# EAGLE design Teensy_setup (EAGLE 9.4.2)
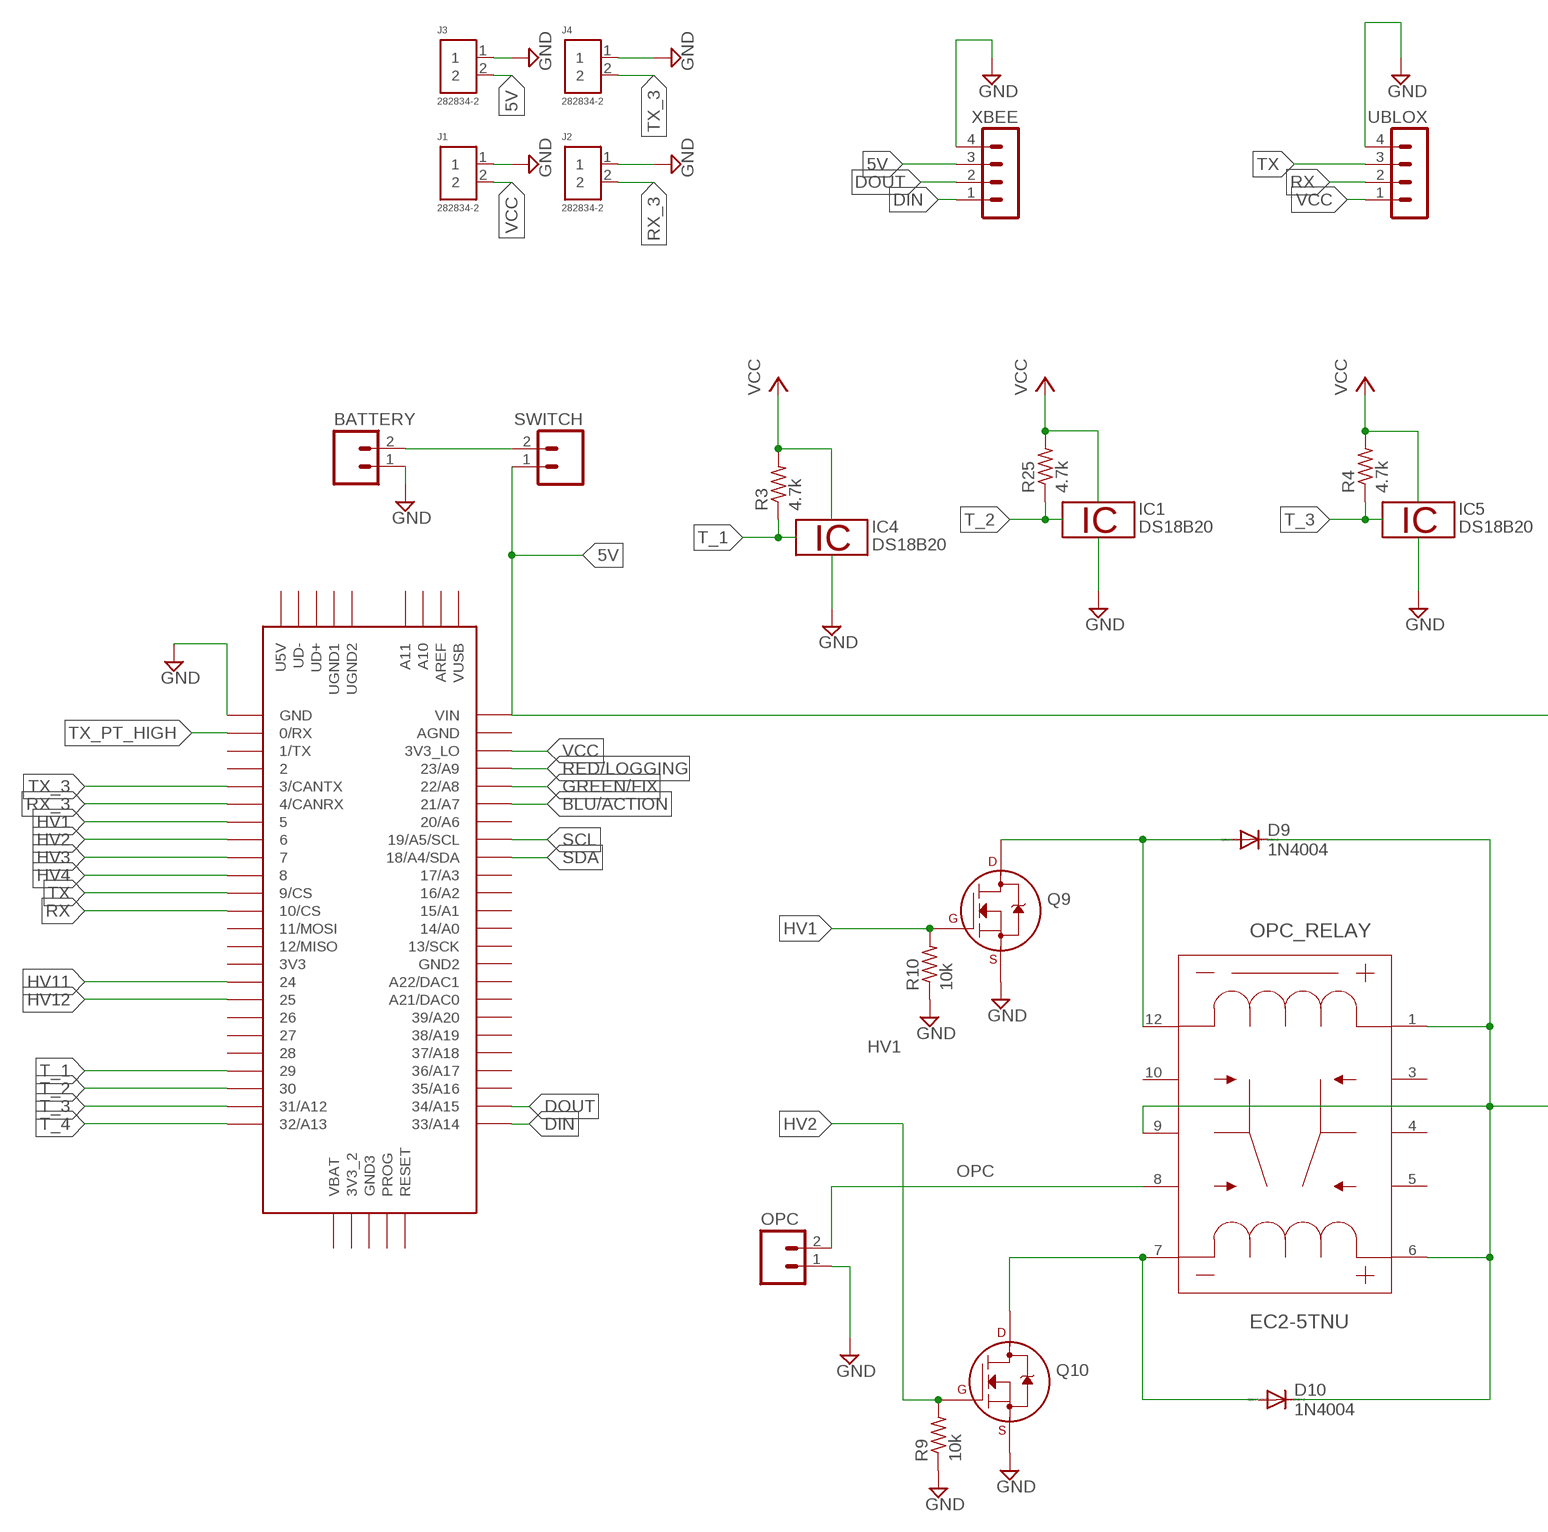
[diagram p0: schematic, sheet 1, part 1 of 2]
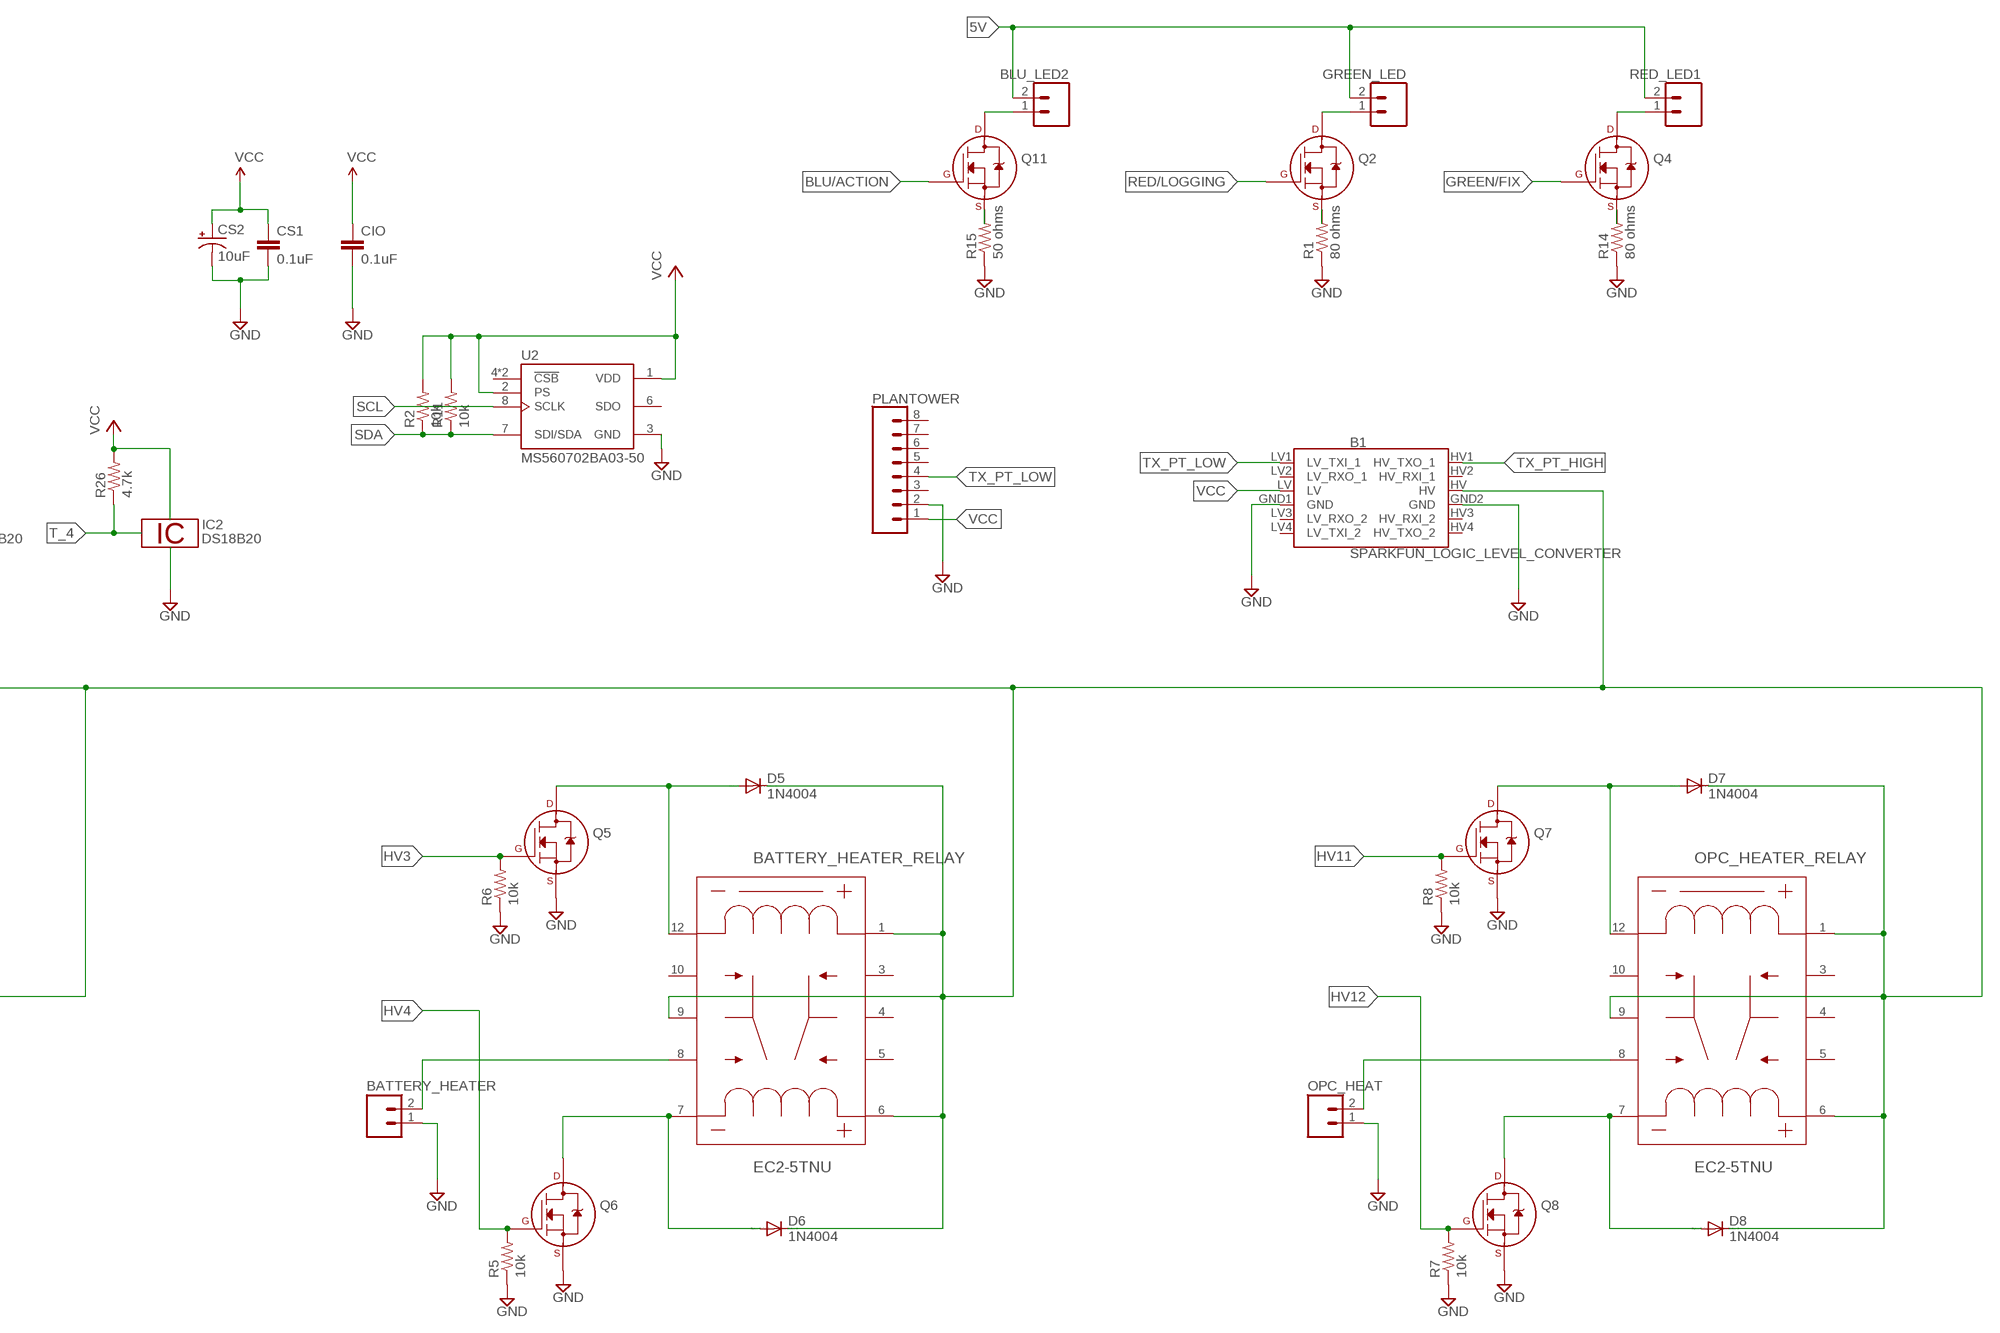
[diagram p1: schematic, sheet 1, part 2 of 2]

## Parts
B1  SPARKFUN_LOGIC_LEVEL_CONVERTER  [SPARKFUN_LOGIC_LEVEL_CONVERTER]
BATTERY  M02  [02P]
BATTERY_HEATER  M02  [02P]
BATTERY_HEATER_RELAY  EC2-5TNU  [EC2TNU]
BLU_LED2  M02  [02P]
CIO  0.1uF  CAP0402-CAP  [0402-CAP]
CS1  0.1uF  CAP0402-CAP  [0402-CAP]
CS2  10uF  CAP_POL1206  [EIA3216]
D5  1N4004  [DO41-10]
D6  1N4004  [DO41-10]
D7  1N4004  [DO41-10]
D8  1N4004  [DO41-10]
D9  1N4004  [DO41-10]
D10  1N4004  [DO41-10]
GREEN_LED  M02  [02P]
IC1  DS18B20  [TO92-]
IC2  DS18B20  [TO92-]
IC4  DS18B20  [TO92-]
IC5  DS18B20  [TO92-]
J1  282834-2  [CONN_282834-2]
J2  282834-2  [CONN_282834-2]
J3  282834-2  [CONN_282834-2]
J4  282834-2  [CONN_282834-2]
OPC  M02  [02P]
OPC_HEAT  M02  [02P]
OPC_HEATER_RELAY  EC2-5TNU  [EC2TNU]
OPC_RELAY  EC2-5TNU  [EC2TNU]
PLANTOWER  CONN_08"  [1X08]
Q2  2N7000_TO92  [TO-92]
Q4  2N7000_TO92  [TO-92]
Q5  2N7000_TO92  [TO-92]
Q6  2N7000_TO92  [TO-92]
Q7  2N7000_TO92  [TO-92]
Q8  2N7000_TO92  [TO-92]
Q9  2N7000_TO92  [TO-92]
Q10  2N7000_TO92  [TO-92]
Q11  2N7000_TO92  [TO-92]
R1  80 ohms  R-US_0207/7  [0207/7]
R2  10k  R-US_0204/7  [0204/7]
R3  4.7k  R-US_0204/7  [0204/7]
R4  4.7k  R-US_0204/7  [0204/7]
R5  10k  R-US_0207/7  [0207/7]
R6  10k  R-US_0207/7  [0207/7]
R7  10k  R-US_0207/7  [0207/7]
R8  10k  R-US_0207/7  [0207/7]
R9  10k  R-US_0207/7  [0207/7]
R10  10k  R-US_0207/7  [0207/7]
R11  10k  R-US_0204/7  [0204/7]
R14  80 ohms  R-US_0207/7  [0207/7]
R15  50 ohms  R-US_0207/7  [0207/7]
R25  4.7k  R-US_0204/7  [0204/7]
R26  4.7k  R-US_0204/7  [0204/7]
RED_LED1  M02  [02P]
SWITCH  M02  [02P]
U2  MS560702BA03-50  [SON125P300X500X100-8N]
U$1  TEENSY_3.5/3.6  [TEENSY_3.5/3.6]
UBLOX  MA04-1  [MA04-1]
XBEE  MA04-1  [MA04-1]

## Nets
5V [5V_Relay]: BLU_LED2.2 GREEN_LED.2 J3.2 RED_LED1.2 SWITCH.1 U$1.VIN XBEE.3
5V2 [5V_Relay]: B1.HV BATTERY_HEATER_RELAY.1 BATTERY_HEATER_RELAY.6 BATTERY_HEATER_RELAY.9 D5.C D6.C D7.C D8.C D9.C D10.C OPC_HEATER_RELAY.1 OPC_HEATER_RELAY.6 OPC_HEATER_RELAY.9 OPC_RELAY.1 OPC_RELAY.6 OPC_RELAY.9
BATTERY_HEATER [5V_Relay]: OPC_HEAT.2 OPC_HEATER_RELAY.8
BLU/ACTION: Q11.2(G) U$1.21/A7
DIN: U$1.33/A14 XBEE.1
DOUT: U$1.34/A15 XBEE.2
GND [5V_Relay]: B1.GND1(GND) B1.GND2(GND) BATTERY.1 BATTERY_HEATER.1 CIO.2 CS1.2 CS2.C(-) J1.1 J2.1 J3.1 J4.1 OPC.1 OPC_HEAT.1 PLANTOWER.2 Q5.1(S) Q6.1(S) Q7.1(S) Q8.1(S) Q9.1(S) Q10.1(S) R1.1 R5.1 R6.1 R7.1 R8.1 R9.1 R10.1 R14.1 R15.1 U2.3(GND) U$1.GND UBLOX.4 XBEE.4
GREEN/FIX: Q4.2(G) U$1.22/A8
HV1: Q9.2(G) R10.2 U$1.5
HV2: Q10.2(G) R9.2 U$1.6
HV3: Q5.2(G) R6.2 U$1.7
HV4: Q6.2(G) R5.2 U$1.8
HV11: Q7.2(G) R8.2 U$1.24
HV12: Q8.2(G) R7.2 U$1.25
N$1: BATTERY.2 SWITCH.2
N$4: Q2.1(S) R1.2
N$5: GREEN_LED.1 Q2.3(D)
N$6: Q4.1(S) R14.2
N$8 [5V_Relay]: BATTERY_HEATER_RELAY.12 D5.A Q5.3(D)
N$9 [5V_Relay]: BATTERY_HEATER_RELAY.7 D6.A Q6.3(D)
N$10 [5V_Relay]: D7.A OPC_HEATER_RELAY.12 Q7.3(D)
N$11 [5V_Relay]: D8.A OPC_HEATER_RELAY.7 Q8.3(D)
N$12 [5V_Relay]: D9.A OPC_RELAY.12 Q9.3(D)
N$13 [5V_Relay]: D10.A OPC_RELAY.7 Q10.3(D)
N$16: Q4.3(D) RED_LED1.1
N$17: Q11.1(S) R15.2
N$18: BLU_LED2.1 Q11.3(D)
OPC [5V_Relay]: BATTERY_HEATER.2 BATTERY_HEATER_RELAY.8 OPC.2 OPC_RELAY.8
RED/LOGGING: Q2.2(G) U$1.23/A9
RX: U$1.10/CS UBLOX.2
RX_3: J2.2 U$1.4/CANRX
SCL: U2.8(SCLK) U$1.19/A5/SCL
SDA: R2.1 R11.1 U2.7(SDI/SDA) U$1.18/A4/SDA
T_1: R3.1 U$1.29
T_2: R25.1 U$1.30
T_3: R4.1 U$1.31/A12
T_4: R26.1 U$1.32/A13
TX: U$1.9/CS UBLOX.3
TX_3: J4.2 U$1.3/CANTX
TX_PT_HIGH: B1.HV1(HV_TXO_1) U$1.0/RX
TX_PT_LOW: B1.LV1(LV_TXI_1) PLANTOWER.4
VCC: B1.LV CIO.1 CS1.1 CS2.A(+) J1.2 PLANTOWER.1 R2.2 R3.2 R4.2 R11.2 R25.2 R26.2 U2.1(VDD) U2.2(PS) U$1.3V3_LO UBLOX.1
Unconnected: B1.HV2(HV_RXI_1) B1.HV3(HV_RXI_2) B1.HV4(HV_TXO_2) B1.LV2(LV_RXO_1) B1.LV3(LV_RXO_2) B1.LV4(LV_TXI_2) BATTERY_HEATER_RELAY.3 BATTERY_HEATER_RELAY.4 BATTERY_HEATER_RELAY.5 BATTERY_HEATER_RELAY.10 OPC_HEATER_RELAY.3 OPC_HEATER_RELAY.4 OPC_HEATER_RELAY.5 OPC_HEATER_RELAY.10 OPC_RELAY.3 OPC_RELAY.4 OPC_RELAY.5 OPC_RELAY.10 PLANTOWER.3 PLANTOWER.5 PLANTOWER.6 PLANTOWER.7 PLANTOWER.8 U2.4(!CSB) U2.5(!CSB) U2.6(SDO) U$1.1/TX U$1.2 U$1.3V3 U$1.3V3_2 U$1.11/MOSI U$1.12/MISO U$1.13/SCK U$1.14/A0 U$1.15/A1 U$1.16/A2 U$1.17/A3 U$1.20/A6 U$1.21/DAC0(A21/DAC0) U$1.26 U$1.27 U$1.28 U$1.35/A16 U$1.36/A17 U$1.37/A18 U$1.38/A19 U$1.39/A20 U$1.A10 U$1.A11 U$1.A22/DAC1 U$1.AGND U$1.AREF U$1.GND2 U$1.GND3 U$1.PROG U$1.RESET U$1.U5V U$1.UD+ U$1.UD- U$1.UGND1 U$1.UGND2 U$1.VBAT U$1.VUSB

## Power pins joined to a net without a drawn wire
1W: IC1.2 IC2.2 IC4.2 IC5.2
GND: IC1.1 IC2.1 IC4.1 IC5.1
VDD: IC1.3 IC2.3 IC4.3 IC5.3

## Library data of the parts
B1 = SparkFun-Boards:SPARKFUN_LOGIC_LEVEL_CONVERTER: SparkFun Logic Level Converter -Bi-Directional This is the mechnical outline for the 3.3V - 5V bi directional logic level converter. *Note, the "LOCK" Package has the header pins staggered by an offset of 5 mils (off center line), so that when you slide a row of standard 0.1" headers into the PTH pads, it will hold position vertically. See the follwing turorial for more information on this type of special footprints: Sneaky Footprints <https://www.sparkfun.com/tutorials/114> SparkFun Products: SparkFun Logic Level Converter - Bi-Directional <https://www.sparkfun.com/products/12009>
BATTERY BATTERY_HEATER BLU_LED2 GREEN_LED OPC OPC_HEAT RED_LED1 SWITCH = con-amp-quick:M02: AMP QUICK CONNECTOR; OC_FARNELL: unknown; OC_NEWARK: unknown
BATTERY_HEATER_RELAY OPC_HEATER_RELAY OPC_RELAY = EC2-5TNU:EC2-5TNU; MANUFACTURER_PART_NUMBER: EC25TNU; VENDOR: KEMET
CIO CS1 = SparkFun:CAP: Capacitor Standard 0603 ceramic capacitor, and 0.1" leaded capacitor.
CS2 = SparkFun:CAP_POL: Capacitor Polarized These are standard SMD and PTH capacitors. Normally 10uF, 47uF, and 100uF in electrolytic and tantalum varieties. Always verify the external diameter of the through hole cap, it varies with capacity, voltage, and manufacturer. The EIA devices should be standard.
D5-D10 = diode:1N4004: DIODE general purpose rectifier, 1 A
IC1 IC2 IC4 IC5 = 1wire:DS18B20: Programmable Resolution Digital Thermometer This chip provides a onewire thermosensor with approx. 0.5°C accuracy. A programmable over/undertemperure alarm is available. The precision can be set from 9..12 bits. Notes: Vdd must be applied for accurate measurements at low temperatures, as the parasite power circuit otherwise heats the sensor. If parasite power is used, Vdd has to be connected to GND. The DS1822 is a low-cost thermometer chip, the DS18S20 is similar to the DS18B20, but with 9 Bit precision only. Author: Jan Kandziora <jjj@gmx.de>
J1-J4 = 282834-2:282834-2: Terminal block; 2.54mm; angled 90°; 0.03÷1mm2; ways: 2; 10A; H: 10mm; CENTERLINE_PITCH: 2.54 mm[.1 in]; COMMENT: 282834-2; DESCRIPTION: TERMI-BLOK PCB MOUNT, 90 2P.; DIGI-KEY_PART_NUMBER: A98333-ND; DIGI-KEY_PURCHASE_URL: https://www.digikey.com/product-detail/en/te-connectivity-amp-connectors/282834-2/A98333-ND/1150135?utm_source=snapeda&utm_medium=aggregator&utm_campaign=symbol; EU_ROHS_COMPLIANCE: Compliant with Exemptions; MF: TE Connectivity; MP: 282834-2; NUMBER_OF_POSITIONS: 2; PACKAGE: None; TE_PURCHASE_URL: https://www.te.com/usa-en/product-282834-2.html?te_bu=Cor&te_type=disp&te_campaign=seda_glo_cor-seda-global-disp-prtnr-fy19-seda-model-bom-cta_sma-317_1&elqCampaignId=32493
PLANTOWER = SparkFun-Connectors:CONN_08: Multi connection point. Often used as Generic Header-pin footprint for 0.1 inch spaced/style header connections On any of the 0.1 inch spaced packages, you can populate with these: Break Away Headers - Straight <https://www.sparkfun.com/products/116> (PRT-00116) Break Away Male Headers - Right Angle <https://www.sparkfun.com/products/553> (PRT-00553) Female Headers <https://www.sparkfun.com/products/115> (PRT-00115) Break Away Headers - Machine Pin <https://www.sparkfun.com/products/117> (PRT-00117) Break Away Female Headers - Swiss Machine Pin <https://www.sparkfun.com/products/743> (PRT-00743) Arduino Stackable Header - 8 Pin <https://www.sparkfun.com/products/9279> (PRT-09279) For SCREWTERMINALS and SPRING TERMINALS visit here: Screw Terimnals on SparkFun.com <https://www.sparkfun.com/search/results?term=Screw+Terminals> (5mm/3.5mm/2.54mm spacing) This device is also useful as a general connection point to wire up your design to another part of your project. Our various solder wires solder well into these plated through hole pads. Hook-Up Wire - Assortment (Stranded, 22 AWG) <https://www.sparkfun.com/products/11375> (PRT-11375) Hook-Up Wire - Assortment (Solid Core, 22 AWG) <https://www.sparkfun.com/products/11367> (PRT-11367) View the entire wire category on our website here <https://www.sparkfun.com/categories/141> Special notes: Molex polarized connector foot print use with SKU : PRT-08231 with associated crimp pins and housings. 1MM SMD Version SKU: PRT-10208 NOTES ON THE VARIANTS LOCK and LOCK_LONGPADS... This footprint was designed to help hold the alignment of a through-hole component (i.e. 6-pin header) while soldering it into place. You may notice that each hole has been shifted either up or down by 0.005 of an inch from it's more standard position (which is a perfectly straight line). This slight alteration caused the pins (the squares in the middle) to touch the edges of the holes. Because they are alternating, it causes a "brace" to hold the component in place. 0.005 has proven to be the perfect amount of "off-center" position when using our standard breakaway headers. Although looks a little odd when you look at the bare footprint, once you have a header in there, the alteration is very hard to notice. Also,if you push a header all the way into place, it is covered up entirely on the bottom side.; PROD_ID: CONN-08438
Q2 Q4-Q11 = transistors:2N700*: 2N7000, 2N7002, NDS7002A N-channel enhancement mode MOSFET
R1 R3 R4 R14 R15 R25 R26 = resistor:R-US_: RESISTOR, American symbol
R2 R5-R11 = rcl:R-US_: RESISTOR, American symbol; SPICEPREFIX: R
U2 = MS560702BA03-50:MS560702BA03-50: BAROMETRIC PRESSURE SENSOR; COMMENT: MS560702BA03-50; DESCRIPTION: MS5607-02BA03 Series 3 V 1 to 120 kPa Absolute Barometric Pressure Sensor; DIGI-KEY_PART_NUMBER: 223-1198-1-ND; DIGI-KEY_PURCHASE_URL: https://www.digikey.com/product-detail/en/te-connectivity-measurement-specialties/MS560702BA03-50/223-1198-1-ND/4700921?utm_source=snapeda&utm_medium=aggregator&utm_campaign=symbol; EU_ROHS_COMPLIANCE: Compliant; MF: TE Connectivity; MP: MS560702BA03-50; PACKAGE: SMD-8 TE Connectivity; TE_PURCHASE_URL: https://www.te.com/usa-en/product-MS560702BA03-50.html?te_bu=Cor&te_type=disp&te_campaign=seda_glo_cor-seda-global-disp-prtnr-fy19-seda-model-bom-cta_sma-317_1&elqCampaignId=32493
U$1 = Teensy356:TEENSY_3.5/3.6
UBLOX XBEE = con-lstb:MA04-1: PIN HEADER; OC_FARNELL: unknown; OC_NEWARK: unknown

## Net classes
1 5V_Relay: width 0.254 mm, drill 0.889 mm, clearance 0.127 mm

## Board
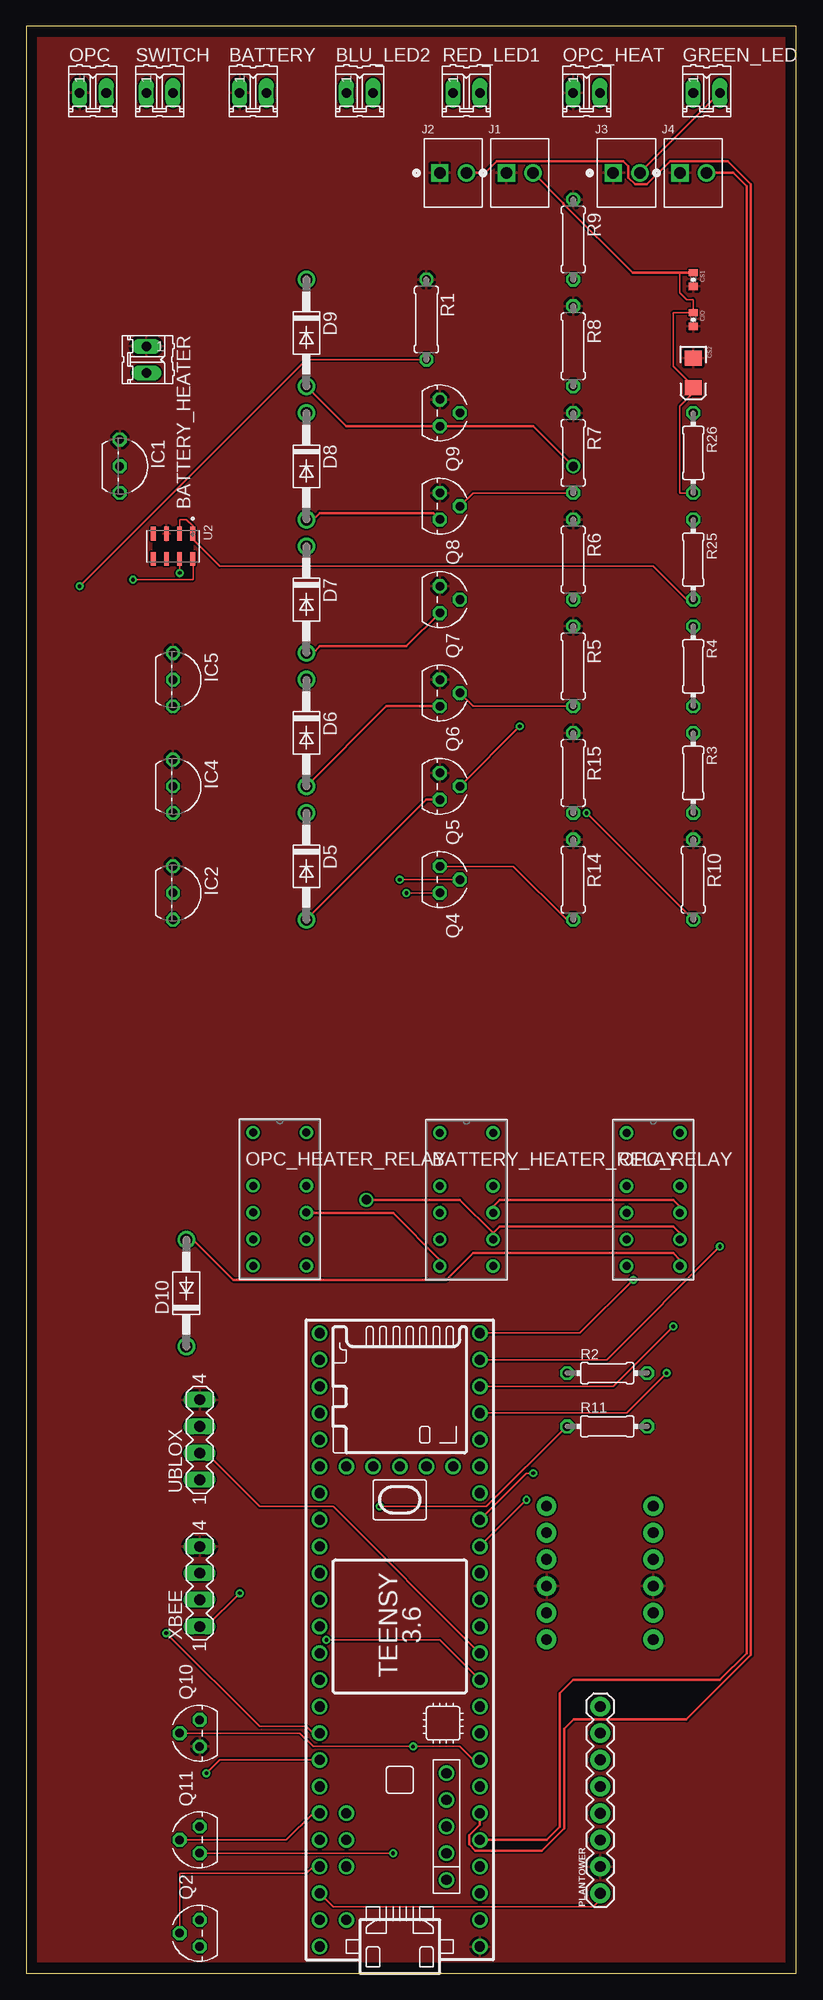
[diagram p2: board, top side]
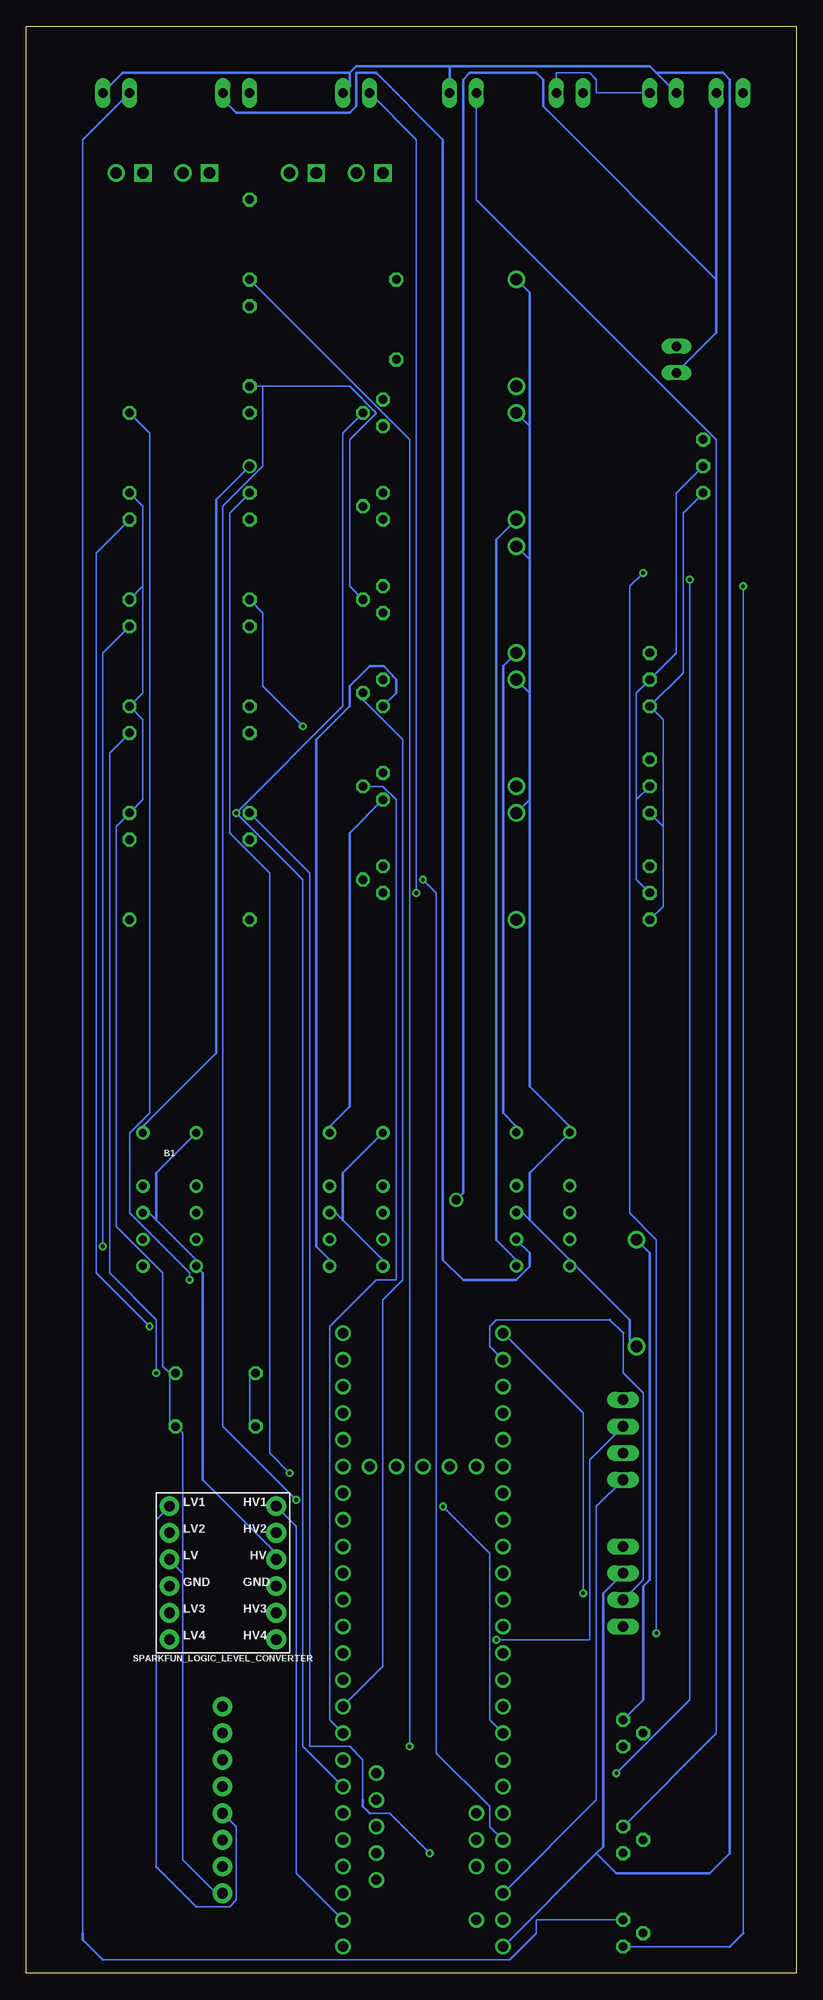
[diagram p3: board, bottom side, seen from below]

Size 73.33 x 185.41 mm. Coordinates in mm from the lower left corner, seen from the top.
Outline: 0,0 73.33,0 73.33,185.41 0,185.41 0,0
Copper layers (1*16): Top 0.035mm / dielectric 1.5mm / Bottom 0.035mm
Design rules "default": minimum track width 6mil, minimum drill 0.35mm, track to track 6mil, track to pad 6mil, pad to pad 6mil, via to via 6mil, smd to smd 6mil, copper to edge 40mil, drill to drill 6mil, minimum pad ring 10mil, minimum via ring 8mil, stop-mask expansion 4mil, vias tented up to drill 0mil, thermal gap 10mil

### Footprints (pad centres in the part's own frame; a part is rotated, then mirrored left to right if it is on the bottom)
SPARKFUN_LOGIC_LEVEL_CONVERTER = drill 1.016 pad 1.88: GND1 -5.08,-1.27; GND2 5.08,-1.27; HV 5.08,1.27; HV1 5.08,6.35; HV2 5.08,3.81; HV3 5.08,-3.81; HV4 5.08,-6.35; LV -5.08,1.27; LV1 -5.08,6.35; LV2 -5.08,3.81; LV3 -5.08,-3.81; LV4 -5.08,-6.35
02P = drill 0.914 long: 1 -1.27,0; 2 1.27,0
EC2TNU = drill 0.762 pad 1.27: 1 -2.54,6.375; 3 -2.54,1.295; 4 -2.54,-1.245; 5 -2.54,-3.785; 6 -2.54,-6.325; 7 2.54,-6.325; 8 2.54,-3.785; 9 2.54,-1.245; 10 2.54,1.295; 12 2.54,6.375
0402-CAP = smd 0.7 x 0.9: 1 -0.65,0; 2 0.65,0
EIA3216 = smd 1.4 x 1.6: A 1.4,0; C -1.4,0
DO41-10 = drill 1.118: A 5.08,0; C -5.08,0
TO92- = drill 0.813 octagon: 1 -2.54,0; 2 0,0; 3 2.54,0
CONN_282834-2 = drill 1.1 square: 1 -1.27,0 | drill 1.1: 2 1.27,0
1X08 = drill 1.016 pad 1.88: 1 0,0; 2 2.54,0; 3 5.08,0; 4 7.62,0; 5 10.16,0; 6 12.7,0; 7 15.24,0; 8 17.78,0
TO-92 = drill 0.813 octagon: 1 -1.27,0; 2 0,1.905; 3 1.27,0
0207/7 = drill 0.813 octagon: 1 -3.81,0; 2 3.81,0
0204/7 = drill 0.813 octagon: 1 -3.81,0; 2 3.81,0
SON125P300X500X100-8N = smd 1.31 x 0.53: 1 -1.2,1.875; 2 -1.2,0.625; 3 -1.2,-0.625; 4 -1.2,-1.875; 5 1.2,-1.875; 6 1.2,-0.625; 7 1.2,0.625; 8 1.2,1.875
TEENSY_3.5/3.6 = drill 0.965: 0/RX -25.4,-7.62; 1/TX -22.86,-7.62; 2 -20.32,-7.62; 3/CANTX -17.78,-7.62; 3V3 7.62,-7.62; 3V3_2 17.78,-2.54; 3V3_LO -22.86,7.62; 4/CANRX -15.24,-7.62; 5 -12.7,-7.62; 6 -10.16,-7.62; 7 -7.62,-7.62; 8 -5.08,-7.62; 9/CS -2.54,-7.62; 10/CS 0,-7.62; 11/MOSI 2.54,-7.62; 12/MISO 5.08,-7.62; 13/SCK 5.08,7.62; 14/A0 2.54,7.62; 15/A1 0,7.62; 16/A2 -2.54,7.62; 17/A3 -5.08,7.62; 18/A4/SDA -7.62,7.62; 19/A5/SCL -10.16,7.62; 20/A6 -12.7,7.62; 21/A7 -15.24,7.62; 21/DAC0 12.7,7.62; 22/A8 -17.78,7.62; 23/A9 -20.32,7.62; 24 10.16,-7.62; 25 12.7,-7.62; 26 15.24,-7.62; 27 17.78,-7.62; 28 20.32,-7.62; 29 22.86,-7.62; 30 25.4,-7.62; 31/A12 27.94,-7.62; 32/A13 30.48,-7.62; 33/A14 30.48,7.62; 34/A15 27.94,7.62; 35/A16 25.4,7.62; 36/A17 22.86,7.62; 37/A18 20.32,7.62; 38/A19 17.78,7.62; 39/A20 15.24,7.62; A10 -17.78,5.08; A11 -15.24,5.08; A22/DAC1 10.16,7.62; AGND -25.4,7.62; AREF -20.32,5.08; GND -27.94,-7.62; GND2 7.62,7.62; GND3 17.78,0; PROG 17.78,2.54; RESET 17.78,5.08; U5V -21.59,-4.445; UD+ -16.51,-4.445; UD- -19.05,-4.445; UGND1 -13.97,-4.445; UGND2 -11.43,-4.445; VBAT 17.78,-5.08; VIN -27.94,7.62; VUSB -25.4,5.08
MA04-1 = drill 1.016 long: 1 -3.81,0; 2 -1.27,0; 3 1.27,0; 4 3.81,0

### Placement (x,y rotation side)
B1  54.61,38.14 0 bottom
BATTERY  21.59,179.07 0 top
BATTERY_HEATER  11.43,153.67 270 top
BATTERY_HEATER_RELAY  41.91,73.66 0 top
BLU_LED2  31.75,179.07 0 top
CIO  63.5,157.48 270 top
CS1  63.5,161.29 270 top
CS2  63.5,152.4 270 top
D5  26.67,105.41 270 top
D6  26.67,118.11 270 top
D7  26.67,130.81 270 top
D8  26.67,143.51 270 top
D9  26.67,156.21 270 top
D10  15.24,64.77 90 top
GREEN_LED  64.77,179.07 0 top
IC1  8.89,143.51 270 top
IC2  13.97,102.87 270 top
IC4  13.97,113.03 270 top
IC5  13.97,123.19 270 top
J1  46.99,171.45 0 top
J2  40.64,171.45 0 top
J3  57.15,171.45 0 top
J4  63.5,171.45 0 top
OPC  6.35,179.07 0 top
OPC_HEAT  53.34,179.07 0 top
OPC_HEATER_RELAY  24.13,73.69 0 top
OPC_RELAY  59.69,73.66 0 top
PLANTOWER  54.65,7.62 90 top
Q2  16.51,3.81 90 top
Q4  39.37,104.14 270 top
Q5  39.37,113.03 270 top
Q6  39.37,121.92 270 top
Q7  39.37,130.81 270 top
Q8  39.37,139.7 270 top
Q9  39.37,148.59 270 top
Q10  16.51,22.86 90 top
Q11  16.51,12.7 90 top
R1  38.1,157.48 270 top
R2  55.31,57.15 0 top
R3  63.5,114.3 270 top
R4  63.5,124.46 270 top
R5  52.07,124.46 270 top
R6  52.07,134.62 270 top
R7  52.07,144.78 270 top
R8  52.07,154.94 270 top
R9  52.07,165.1 270 top
R10  63.5,104.14 270 top
R11  55.31,52.07 0 top
R14  52.07,104.14 270 top
R15  52.07,114.3 270 top
R25  63.5,134.62 270 top
R26  63.5,144.78 270 top
RED_LED1  41.91,179.07 0 top
SWITCH  12.7,179.07 0 top
U2  13.97,135.89 270 top
U$1  35.56,30.48 90 top
UBLOX  16.51,50.8 90 top
XBEE  16.51,36.83 90 top

### Tracks (layer width: path | path; a pad name or v marks a point on that pad's centre or on a via)
1W
  Bottom 0.152: IC2.2 15.24,104.14 15.24,111.76 | IC4.2 15.24,111.76 | 15.24,111.76 15.24,121.92 IC5.2 11.43,125.73 11.43,140.97 IC1.2
5V
  Top 0.254: J3.2 GREEN_LED.2
  Bottom 0.254: 19.05,11.43 18.42,12.06 18.42,36.2 XBEE.3 | 19.05,11.43 U$1.VIN | 13.34,180.97 13.97,181.61 33.02,181.61 | 13.34,180.97 SWITCH.1 | BLU_LED2.2 33.02,181.61 | RED_LED1.2 42.55,179.71 42.55,180.97 | 42.55,180.97 41.91,181.61 33.02,181.61 | GREEN_LED.2 64.13,180.97 42.55,180.97 | 19.05,11.43 17.14,9.53 8.26,9.53 6.35,11.43 6.35,180.34 6.99,180.97 13.34,180.97
5V2
  Top 0.254: BATTERY_HEATER_RELAY.6 39.37,67.94 34.92,72.39 26.67,72.39 OPC_HEATER_RELAY.9 | OPC_RELAY.9 62.23,73.03 61.59,73.66 45.09,73.66 44.45,73.03 BATTERY_HEATER_RELAY.9
  Bottom 0.254: 60.96,71.75 62.23,73.03 OPC_RELAY.9 | 60.96,71.75 57.15,67.94 OPC_RELAY.6 57.15,67.31 56.52,66.67 56.52,46.99 49.53,40.01 B1.HV | 60.96,71.75 60.96,76.2 57.15,80.01 OPC_RELAY.1 | 43.18,71.75 44.45,73.03 BATTERY_HEATER_RELAY.9 | 43.18,71.75 39.37,67.94 BATTERY_HEATER_RELAY.6 | 43.18,71.75 43.18,76.2 39.37,80.01 BATTERY_HEATER_RELAY.1 | 25.4,71.75 26.67,73.03 OPC_HEATER_RELAY.9 | 25.4,71.75 21.59,67.94 | 25.4,71.75 25.4,76.2 21.59,80.01 OPC_HEATER_RELAY.1 21.59,80.64 25.4,84.45 25.4,111.76 | D10.C 15.88,60.33 15.88,62.23 21.59,67.94 | 21.59,67.94 OPC_HEATER_RELAY.6 | 25.4,111.76 D5.C | 25.4,121.92 25.4,111.76 | D6.C 25.4,121.92 | 25.4,134.62 D7.C | 25.4,121.92 25.4,134.62 | 25.4,147.32 D8.C | 25.4,134.62 25.4,147.32 | D9.C 25.4,160.02 25.4,147.32
BATTERY_HEATER
  Bottom 0.254: OPC_HEATER_RELAY.8 26.67,69.85 25.4,68.58 25.4,67.31 26.67,66.04 31.75,66.04 33.66,67.94 33.66,174.62 40.01,180.97 41.91,180.97 41.91,177.8 42.55,177.16 53.34,177.16 54.61,178.44 OPC_HEAT.2
BLU/ACTION
  Top 0.152: Q11.2 24.77,12.7 27.3,15.24 U$1.21/A7
DIN  (via drill 0.35)
  Top 0.152: v20.32,36.2 17.14,33.02 XBEE.1
  Bottom 0.152: U$1.33/A14 20.32,53.34 v20.32,36.2
DOUT
  Bottom 0.152: U$1.34/A15 29.21,59.69 29.21,61.59 28.58,62.23 17.78,62.23 | 16.51,60.96 16.51,57.15 14.61,55.24 14.61,37.47 XBEE.2
  Bottom 0.254: 16.51,60.96 17.78,62.23
GND
  pour Top: 0,0 73.66,0 73.66,185.42 0,185.42
GREEN/FIX  (via drill 0.35)
  Top 0.152: v35.56,104.14 Q4.2
  Bottom 0.152: v35.56,104.14 34.29,102.87 34.29,20.95 29.21,15.88 29.21,13.97 U$1.22/A8
HV1  (via drill 0.35)
  Top 0.152: v53.34,110.49 R10.2
  Bottom 0.152: Q9.2 43.18,146.69 43.18,120.65 v53.34,110.49 46.99,104.14 46.99,21.59 U$1.5
HV2  (via drill 0.35)
  Top 0.152: Q10.2 26.04,22.86 27.3,21.59 v36.83,21.59 41.28,21.59 42.55,20.32 U$1.6
  Bottom 0.152: R9.2 36.83,146.05 v36.83,21.59
HV3  (via drill 0.35)
  Top 0.152: v46.99,118.75 Q5.2
  Bottom 0.152: v46.99,118.75 50.8,122.56 50.8,129.54 R6.2 | U$1.7 44.45,24.13 44.45,61.59 40.01,66.04 38.1,66.04 38.1,111.76 39.37,113.03 Q5.2
HV4
  Top 0.152: Q6.2 42.55,120.65 R5.2
  Bottom 0.152: U$1.8 39.37,29.21 39.37,64.14 37.47,66.04 37.47,117.47 41.28,121.28 Q6.2
HV11  (via drill 0.35)
  Top 0.152: v47.62,45.09 U$1.24
  Bottom 0.152: Q7.2 42.55,132.08 42.55,146.05 40.01,148.59 42.55,151.13 50.8,151.13 | 50.8,151.13 R8.2 | v47.62,45.09 54.61,52.07 54.61,139.7 50.8,143.51 50.8,149.86 | 50.8,151.13 50.8,149.86 | 50.8,149.86
HV12  (via drill 0.35)
  Top 0.152: Q8.2 42.55,140.97 R7.2 | U$1.25 47.62,47.62 v48.26,47.62
  Bottom 0.152: v48.26,47.62 50.16,49.53 50.16,104.78 53.98,108.58 53.98,139.06 R7.2
N$1
  Bottom 0.152: SWITCH.2 19.05,179.07 19.05,180.34 19.69,180.97 22.86,180.97 BATTERY.2
N$4  (via drill 0.35)
  Top 0.152: v5.08,132.08 26.67,153.67 R1.2
  Bottom 0.152: 6.35,2.54 Q2.1 | v5.08,132.08 5.08,3.81
  Bottom 0.254: 5.08,3.81 6.35,2.54
N$5
  Bottom 0.152: Q2.3 24.77,5.08 24.77,3.81 27.3,1.27 66.04,1.27 | 67.94,3.81 67.94,174.62 GREEN_LED.1
  Bottom 0.254: 67.94,3.81 67.94,3.17 66.04,1.27
N$6
  Top 0.152: Q4.1 46.36,105.41 51.44,100.33 R14.2
N$8
  Top 0.254: D5.A 38.1,111.76 Q5.3
  Bottom 0.254: Q5.3 42.55,108.58 42.55,82.55 44.45,80.64 BATTERY_HEATER_RELAY.12
N$9
  Top 0.254: D6.A 34.29,120.65 Q6.3
  Bottom 0.254: Q6.3 38.1,121.92 38.1,123.19 38.43,123.52 38.43,123.58 39.31,124.46 40.64,124.46 42.55,122.56 42.55,120.65 45.72,117.47 45.72,69.22 44.45,67.94 BATTERY_HEATER_RELAY.7
N$10
  Top 0.254: Q7.3 36.2,126.36 27.94,126.36 27.3,125.73 D7.A
  Bottom 0.254: D7.A 27.94,124.46 27.94,81.92 26.67,80.64 OPC_HEATER_RELAY.12
N$11
  Top 0.254: Q8.3 38.73,139.06 27.94,139.06 27.3,138.43 D8.A
  Bottom 0.254: D8.A 28.58,136.53 28.58,69.85 26.67,67.94 OPC_HEATER_RELAY.7
N$12  (via drill 0.89)
  Top 0.254: v52.07,143.51 48.26,147.32 Q9.3 30.48,147.32 D9.A
  Bottom 0.254: v52.07,143.51 55.25,140.34 55.25,87.63 62.23,80.64 OPC_RELAY.12
N$13
  Top 0.254: D10.A 15.88,69.85 19.69,66.04 40.01,66.04 42.55,68.58 61.59,68.58 62.23,67.94 OPC_RELAY.7
  Bottom 0.254: Q10.3 14.61,26.04 14.61,36.83 13.97,37.47 13.97,68.58 D10.A
N$16  (via drill 0.35)
  Top 0.152: v36.2,102.87 Q4.3
  Bottom 0.152: v36.2,102.87 36.2,174.62 RED_LED1.1
N$17  (via drill 0.35)
  Top 0.152: v34.92,11.43 Q11.1
  Bottom 0.152: v34.92,11.43 38.73,15.24 40.64,15.24 | 41.28,16.51 41.28,20.32 42.55,21.59 46.36,21.59 46.36,104.78 R15.2
  Bottom 0.254: 40.64,15.24 41.28,15.88 41.28,16.51
N$18
  Bottom 0.152: Q11.3 7.62,22.86 7.62,146.05 30.48,168.91 BLU_LED2.1
OPC  (via drill 0.89)
  Top 0.254: 44.45,70.48 45.09,71.12 61.59,71.12 62.23,70.48 OPC_RELAY.8 | 44.45,70.48 41.28,73.66 v32.39,73.66 | 44.45,70.48 BATTERY_HEATER_RELAY.8
  Bottom 0.254: BATTERY_HEATER.2 7.62,156.21 7.62,161.29 | OPC.2 7.62,161.29 | v32.39,73.66 31.75,74.3 31.75,180.34 31.12,180.97 24.77,180.97 24.13,180.34 24.13,177.8 7.62,161.29
RED/LOGGING
  Top 0.152: Q2.2 14.61,9.53 26.67,9.53 27.3,10.16 U$1.23/A9
RX
  Top 0.152: U$1.10/CS 29.21,44.45 22.23,44.45 17.14,49.53 UBLOX.2
RX_3
  Top 0.254: J2.2 43.67,171.45 44.78,172.55 56.82,172.55 57.32,172.06 57.32,170.99 57.96,170.35 59.08,170.35 61.29,172.55 66.78,172.55 68.99,170.35 68.99,30.31 62.86,24.18 52.12,24.18 51.21,23.27 51.21,13.8 49.09,11.68 42.76,11.68 42.16,12.28 42.16,13.12 43.18,14.14 U$1.4/CANRX
SCL  (via drill 0.35)
  Top 0.152: v10.16,132.72 15.88,132.72 15.88,134.62 U2.8 | v17.14,19.05 18.42,20.32 U$1.19/A5/SCL
  Bottom 0.152: v10.16,132.72 10.16,26.04 v17.14,19.05
SDA  (via drill 0.35)
  Top 0.152: v14.61,133.35 14.61,134.62 U2.7 | v13.34,32.38 22.23,23.5 26.67,23.5 27.3,22.86 U$1.18/A4/SDA | v33.66,44.45 43.81,44.45 51.44,52.07 R11.1
  Bottom 0.152: R11.1 52.07,52.07 52.07,57.15 R2.1 | v14.61,133.35 15.88,132.08 15.88,72.39 13.34,69.85 v13.34,32.38 | v33.66,44.45 29.21,40.01 29.21,24.13 U$1.18/A4/SDA
T_1  (via drill 0.35)
  Top 0.152: v60.96,57.15 57.15,53.34 U$1.29
  Bottom 0.152: R3.1 65.41,116.2 65.41,66.67 60.96,62.23 v60.96,57.15
T_2  (via drill 0.35)
  Top 0.152: v61.59,61.59 55.88,55.88 U$1.30
  Bottom 0.152: R25.1 66.68,135.25 66.68,66.67 v61.59,61.59
T_3  (via drill 0.35)
  Top 0.152: v66.04,69.22 55.25,58.42 U$1.31/A12
  Bottom 0.152: R4.1 66.04,125.73 v66.04,69.22
T_4  (via drill 0.35)
  Top 0.152: v57.79,66.04 52.7,60.96 U$1.32/A13
  Bottom 0.152: R26.1 61.59,146.69 61.59,81.92 63.5,80.01 63.5,72.39 57.79,66.67 v57.79,66.04
TX  (via drill 0.35)
  Top 0.152: U$1.9/CS 39.37,31.75 v28.58,31.75
  Bottom 0.152: v28.58,31.75 19.69,31.75 19.69,48.9 UBLOX.3
TX_3
  Top 0.254: J4.2 67.31,171.45 68.58,170.18 68.58,30.48 66.04,27.94 52.07,27.94 50.8,26.67 50.8,13.97 49.53,12.7 U$1.3/CANTX
TX_PT_HIGH
  Bottom 0.152: U$1.0/RX 47.62,9.53 47.62,42.55 49.53,44.45 B1.HV1
TX_PT_LOW
  Bottom 0.152: 57.15,6.35 53.98,6.35 53.34,6.99 53.34,13.97 54.61,15.24 PLANTOWER.4 | 60.96,10.16 60.96,43.18 59.69,44.45 B1.LV1
  Bottom 0.254: 60.96,10.16 57.15,6.35
VCC
  Top 0.152: U$1.3V3_LO 29.21,6.35 53.98,6.35 55.25,7.62 PLANTOWER.1 | CS1.1 63.5,161.93 62.23,161.93 62.23,160.02 62.87,159.38 63.5,159.38 CIO.1 63.5,158.12 61.59,158.12 61.59,153.03 63.5,151.13 CS2.A 63.5,150.5 62.23,149.22 62.23,140.97 R26.2 | U2.2 14.61,137.16 14.61,138.43 15.24,138.43 15.88,137.79 15.88,137.16 U2.1 15.88,136.53 18.42,133.99 59.69,133.99 62.87,130.81 R25.2
  Top 0.254: J1.2 51.13,168.58 51.13,168.52 57.73,161.93 63.5,161.93
  Bottom 0.152: U$1.3V3_LO 19.05,16.51 19.05,44.45 UBLOX.1 | 59.69,57.15 59.69,52.07 R11.2 59.05,52.07 58.42,51.44 58.42,38.1 | 58.42,38.1 58.42,10.79 55.25,7.62 PLANTOWER.1 | 58.42,38.1 59.69,39.37 B1.LV | R26.2 62.23,139.7 62.23,132.08 | R25.2 62.23,132.08 | 62.23,132.08 62.23,121.92 R4.2 62.23,119.38 62.23,111.76 R3.2 64.77,109.22 64.77,71.12 60.33,66.67 60.33,57.78 59.69,57.15 | 59.69,57.15 R2.2
VDD
  Bottom 0.152: IC2.3 12.7,101.6 12.7,109.22 | IC4.3 12.7,109.22 | 12.7,109.22 12.7,119.38 IC5.3 10.8,123.83 10.8,139.06 IC1.3